# EAGLE design atx_breakout (EAGLE 6.4)
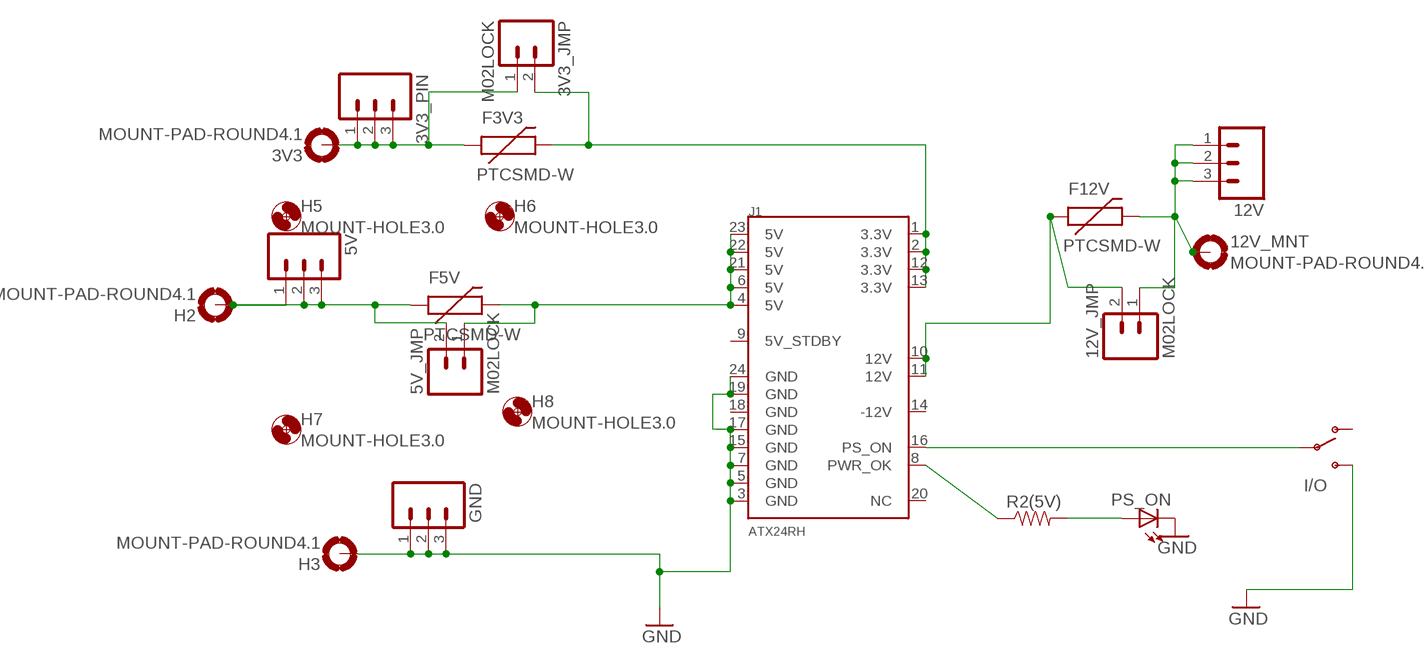
[diagram p0: schematic, sheet 1]

## Parts
3V3  MOUNT-PAD-ROUND4.1  [4,1-PAD]
3V3_JMP  M02LOCK  [1X02_LOCK]
3V3_PIN  M031X03_NO_SILK  [1X03_NO_SILK]
5V  M031X03_NO_SILK  [1X03_NO_SILK]
5V_JMP  M02LOCK  [1X02_LOCK]
12V  M031X03_NO_SILK  [1X03_NO_SILK]
12V_JMP  M02LOCK  [1X02_LOCK]
12V_MNT  MOUNT-PAD-ROUND4.1  [4,1-PAD]
F3V3  PTCSMD-W  [PTC-1206-WIDE]
F5V  PTCSMD-W  [PTC-1206-WIDE]
F12V  PTCSMD-W  [PTC-1206-WIDE]
GND  M031X03_NO_SILK  [1X03_NO_SILK]
H2  MOUNT-PAD-ROUND4.1  [4,1-PAD]
H3  MOUNT-PAD-ROUND4.1  [4,1-PAD]
H5  MOUNT-HOLE3.0  [3,0]
H6  MOUNT-HOLE3.0  [3,0]
H7  MOUNT-HOLE3.0  [3,0]
H8  MOUNT-HOLE3.0  [3,0]
I/O  SWITCH-SPDTPTH  [SWITCH-SPDT]
J1  ATX24RH  [ATX24_RIGHT_ANGLE]
PS_ON  LED-3MM-NO_SILK  [LED3MM-NS]
R2(5V)  RESISTORAXIAL-0.3  [AXIAL-0.3]

## Nets
5VFUSE: 5V.1 5V.2 5V.3 5V_JMP.2 F5V.1 H2.B4,1(MOUNT)
GND: GND.1 GND.2 GND.3 H3.B4,1(MOUNT) I/O.3(S) J1.3(GND) J1.5(GND) J1.7(GND) J1.15(GND) J1.17(GND) J1.19(GND) J1.24(GND) PS_ON.K(C)
N$1: J1.8(PWR_OK) R2(5V).P$1
N$2: 3V3_JMP.2 F3V3.2 J1.1(3.3V) J1.2(3.3V) J1.12(3.3V) J1.13(3.3V)
N$3: 12V_JMP.2 F12V.1 J1.10(12V) J1.11(12V)
N$4: 3V3.B4,1(MOUNT) 3V3_JMP.1 3V3_PIN.1 3V3_PIN.2 3V3_PIN.3 F3V3.1
N$5: 5V_JMP.1 F5V.2 J1.4(5V) J1.6(5V) J1.21(5V) J1.22(5V) J1.23(5V)
N$6: 12V.1 12V.2 12V.3 12V_JMP.1 12V_MNT.B4,1(MOUNT) F12V.2
N$7: PS_ON.A R2(5V).P$2
N$8: I/O.2(P) J1.16(PS_ON)
Unconnected: I/O.1(O) J1.9(5V_STDBY) J1.14(-12V) J1.18(GND) J1.20(NC)

## Library data of the parts
3V3 12V_MNT H2 H3 = holes:MOUNT-PAD-ROUND: MOUNTING PAD, round
3V3_JMP 5V_JMP 12V_JMP = SparkFun-Connectors:M02: Standard 2-pin 0.1" header. Use with - straight break away headers ( PRT-00116) - right angle break away headers (PRT-00553) - swiss pins (PRT-00743) - machine pins (PRT-00117) - female headers (PRT-00115) Molex polarized connector foot print use with: PRT-08233 with associated crimp pins and housings. 2.54_SCREWTERM for use with PRT-10571. 3.5mm Screw Terminal footprints for PRT-08084 5mm Screw Terminal footprints for use with PRT-08433
3V3_PIN 5V 12V GND = SparkFun-Connectors:M03: Header 3 Standard 3-pin 0.1" header. Use with straight break away headers (SKU : PRT-00116), right angle break away headers (PRT-00553), swiss pins (PRT-00743), machine pins (PRT-00117), and female headers (PRT-00115). Molex polarized connector foot print use with SKU : PRT-08232 with associated crimp pins and housings.
F3V3 F5V F12V = SparkFun-PowerIC:PTC: Resettable Fuse PTC Resettable Fuse. Spark Fun Electronics SKU : COM-08357
H5-H8 = holes:MOUNT-HOLE: MOUNTING HOLE with drill center marker
I/O = SparkFun-Electromechanical:SWITCH-SPDT: SPDT Switch Simple slide switch, Spark Fun Electronics SKU : COM-00102 DPDT SMT slide switch, AYZ0202, SWCH-08179
J1 = SparkFun-Connectors:ATX24: ATX24 Pin Power Supply Connector This is a good connector for connecting a computer power supply to a PCB. It's massive, but provides many amps of power at 5V and 12V. SKU: PRT-09498
PS_ON = SparkFun-LED:LED: LEDs Standard schematic elements and footprints for 5mm, 3mm, 1206, and 0603 sized LEDs. 5mm - Spark Fun Electronics SKU : COM-00529 (and others)
R2(5V) = SparkFun-Passives:RESISTOR: Resistor Basic schematic elements and footprints for 0603, 1206, and PTH resistors.

## Board
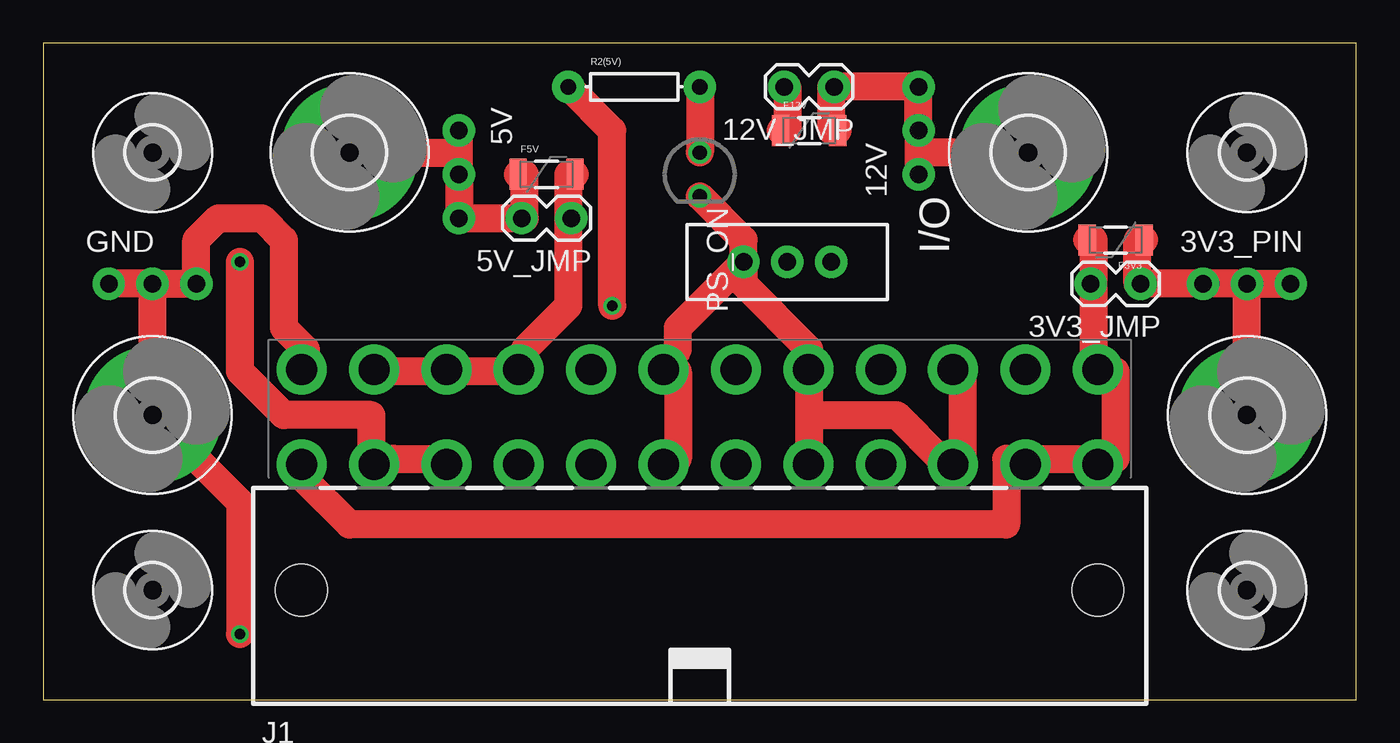
[diagram p1: board, top side]
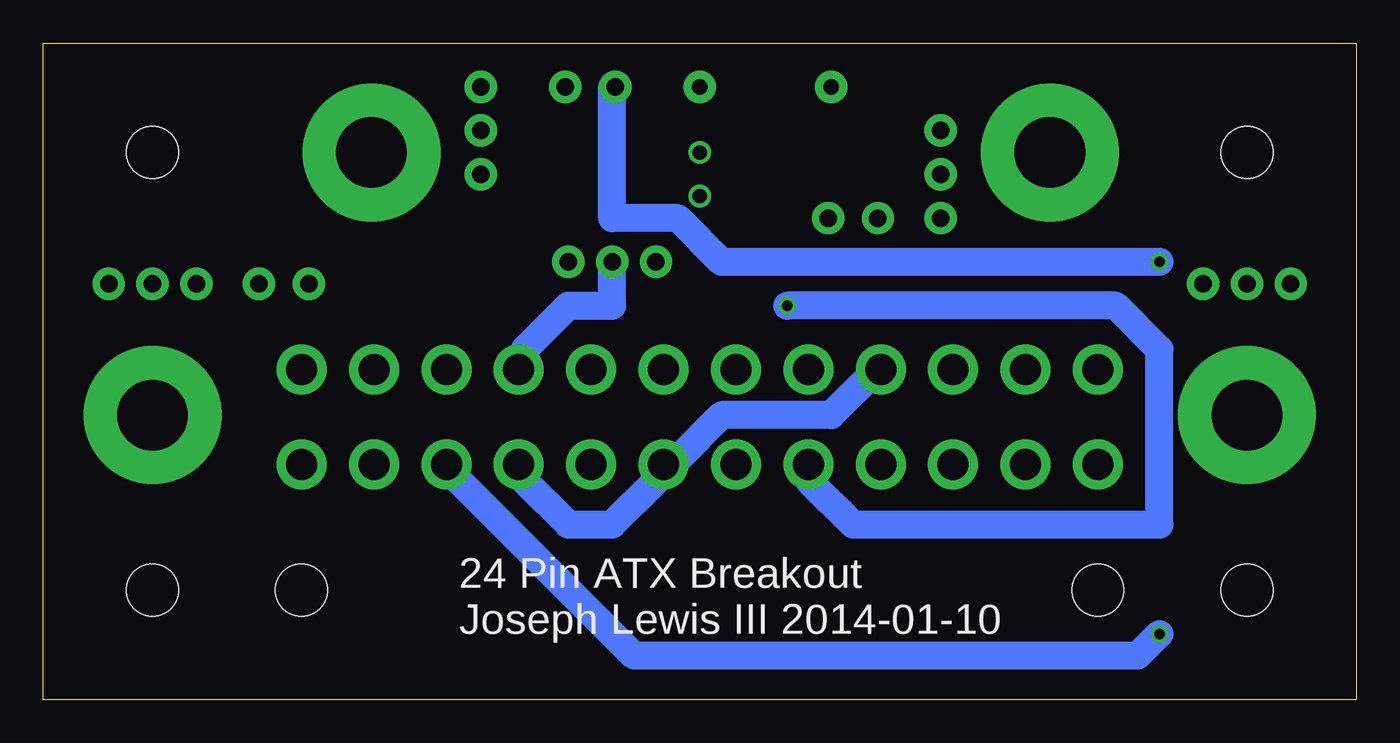
[diagram p2: board, bottom side, seen from below]

Size 76.2 x 38.1 mm. Coordinates in mm from the lower left corner, seen from the top.
Outline: 0,0 76.2,0 76.2,38.1 0,38.1 0,0
Copper layers (1*16): Top 0.035mm / dielectric 1.5mm / Bottom 0.035mm
Design rules "default *": minimum track width 64mil, minimum drill 24mil, track to track 8mil, track to pad 8mil, pad to pad 8mil, via to via 8mil, smd to smd 8mil, copper to edge 40mil, drill to drill 8mil, minimum pad ring 10mil, minimum via ring 8mil, stop-mask expansion 4mil, vias tented up to drill 0mil, thermal gap 10mil

### Footprints (pad centres in the part's own frame; a part is rotated, then mirrored left to right if it is on the bottom)
4,1-PAD = drill 4.1 pad 8: B4,1 0,0
1X02_LOCK = drill 1.016 pad 1.88: 1 -0.178,0; 2 2.718,0
1X03_NO_SILK = drill 1.016 pad 1.88: 1 0,0; 2 2.54,0; 3 5.08,0
PTC-1206-WIDE = smd 1 x 1.8: 1 -1.654,0; 2 1.654,0
3,0 = hole 3: 0,0
SWITCH-SPDT = drill 1.016 pad 1.88: 1 0,2.54; 2 0,0; 3 0,-2.54
ATX24_RIGHT_ANGLE = drill 1.8 pad 2.9: 1 23.1,4.76; 2 18.9,4.76; 3 14.7,4.76; 4 10.5,4.76; 5 6.3,4.76; 6 2.1,4.76; 7 -2.1,4.76; 8 -6.3,4.76; 9 -10.5,4.76; 10 -14.7,4.76; 11 -18.9,4.76; 12 -23.1,4.76; 13 23.1,10.26; 14 18.9,10.26; 15 14.7,10.26; 16 10.5,10.26; 17 6.3,10.26; 18 2.1,10.26; 19 -2.1,10.26; 20 -6.3,10.26; 21 -10.5,10.26; 22 -14.7,10.26; 23 -18.9,10.26; 24 -23.1,10.26 | hole 3: -23.1,-2.54; 23.1,-2.54
LED3MM-NS = drill 0.813: A -1.27,0; K 1.27,0
AXIAL-0.3 = drill 0.9 pad 1.88: P$1 -3.81,0; P$2 3.81,0

### Placement (x,y rotation side)
3V3  69.85,16.51 0 top
3V3_JMP  63.5,24.13 180 top
3V3_PIN  67.31,24.13 0 top
5V  24.13,33.02 270 top
5V_JMP  30.48,27.94 180 top
12V  50.8,30.48 90 top
12V_JMP  45.72,35.56 180 top
12V_MNT  57.15,31.75 0 top
F3V3  62.23,26.67 180 top
F5V  29.21,30.48 0 top
F12V  44.45,33.02 0 top
GND  3.81,24.13 0 top
H2  17.78,31.75 0 top
H3  6.35,16.51 0 top
H5  69.85,6.35 0 top
H6  6.35,31.75 0 top
H7  69.85,31.75 0 top
H8  6.35,6.35 0 top
I/O  43.18,25.4 270 top
J1  38.1,8.89 0 top
PS_ON  38.1,30.48 270 top
R2(5V)  34.29,35.56 0 top

### Tracks (layer width: path | path; a pad name or v marks a point on that pad's centre or on a via)
5VFUSE
  Top 1.626: F5V.1 27.94,30.48 27.94,27.94 5V_JMP.2 5V.3 5V.2 24.13,31.75 | 24.13,31.75 5V.1 | H2.B4,1 24.13,31.75
GND  (via drill 0.61)
  Top 1.626: J1.15 53.34,19.05 53.34,13.97 J1.3 52.07,13.97 49.53,16.51 44.45,16.51 | 44.45,16.51 44.45,19.05 J1.17 44.45,20.32 40.64,24.13 I/O.3 | 44.45,16.51 44.45,13.97 J1.5 | PS_ON.K 40.64,26.67 I/O.3 | I/O.3 36.83,21.59 36.83,20.32 J1.19 36.83,19.05 36.83,13.97 J1.7 | GND.2 GND.1 | GND.2 GND.3 8.89,26.67 10.16,27.94 12.7,27.94 13.97,26.67 13.97,21.59 15.24,20.32 J1.24 | GND.2 H3.B4,1 11.43,11.43 v11.43,3.81
  Bottom 1.626: v11.43,3.81 12.7,2.54 41.91,2.54 52.07,12.7 J1.3
N$1  (via drill 0.61)
  Top 1.626: R2(5V).P$1 33.02,33.02 v33.02,22.86
  Bottom 1.626: v33.02,22.86 13.97,22.86 11.43,20.32 11.43,10.16 29.21,10.16 31.75,12.7 J1.8
N$2
  Top 1.626: 60.96,24.13 60.96,26.67 F3V3.2 | 60.96,24.13 60.96,20.32 J1.13 62.23,19.05 62.23,13.97 J1.1 60.96,13.97 57.15,13.97 J1.2 55.88,13.97 55.88,10.16 17.78,10.16 15.24,12.7 J1.12 | 60.96,24.13 3V3_JMP.2
N$3  (via drill 0.61)
  Top 1.626: F12V.1 43.18,33.02 43.18,35.56 12V_JMP.2 | v11.43,25.4 11.43,19.05 13.97,16.51 19.05,16.51 19.05,13.97 J1.11 20.32,13.97 22.86,13.97 J1.10
  Bottom 1.626: v11.43,25.4 36.83,25.4 39.37,27.94 43.18,27.94 43.18,35.56 12V_JMP.2
N$4
  Top 1.626: F3V3.1 63.5,26.67 63.5,24.13 3V3_JMP.1 3V3_PIN.1 3V3_PIN.2 | 3V3_PIN.2 3V3_PIN.3 | 3V3.B4,1 3V3_PIN.2
N$5
  Top 1.626: J1.23 20.32,19.05 22.86,19.05 J1.22 24.13,19.05 26.67,19.05 J1.21 27.94,20.32 30.48,22.86 30.48,27.94 | 30.48,27.94 30.48,30.48 F5V.2 | 30.48,27.94 5V_JMP.1
  Bottom 1.626: J1.4 48.26,12.7 45.72,10.16 43.18,10.16 40.64,12.7 J1.6 39.37,13.97 36.83,16.51 30.48,16.51 27.94,19.05 J1.21
N$6
  Top 1.626: F12V.2 45.72,33.02 45.72,35.56 12V_JMP.1 12V.3 12V.2 50.8,31.75 | 50.8,31.75 12V.1 | 12V_MNT.B4,1 50.8,31.75
N$7
  Top 1.626: R2(5V).P$2 PS_ON.A
N$8
  Bottom 1.626: I/O.2 43.18,22.86 45.72,22.86 48.26,20.32 J1.16

### Text on the board
bNames: 24 Pin ATX Breakout / Joseph Lewis III 2014-01-10